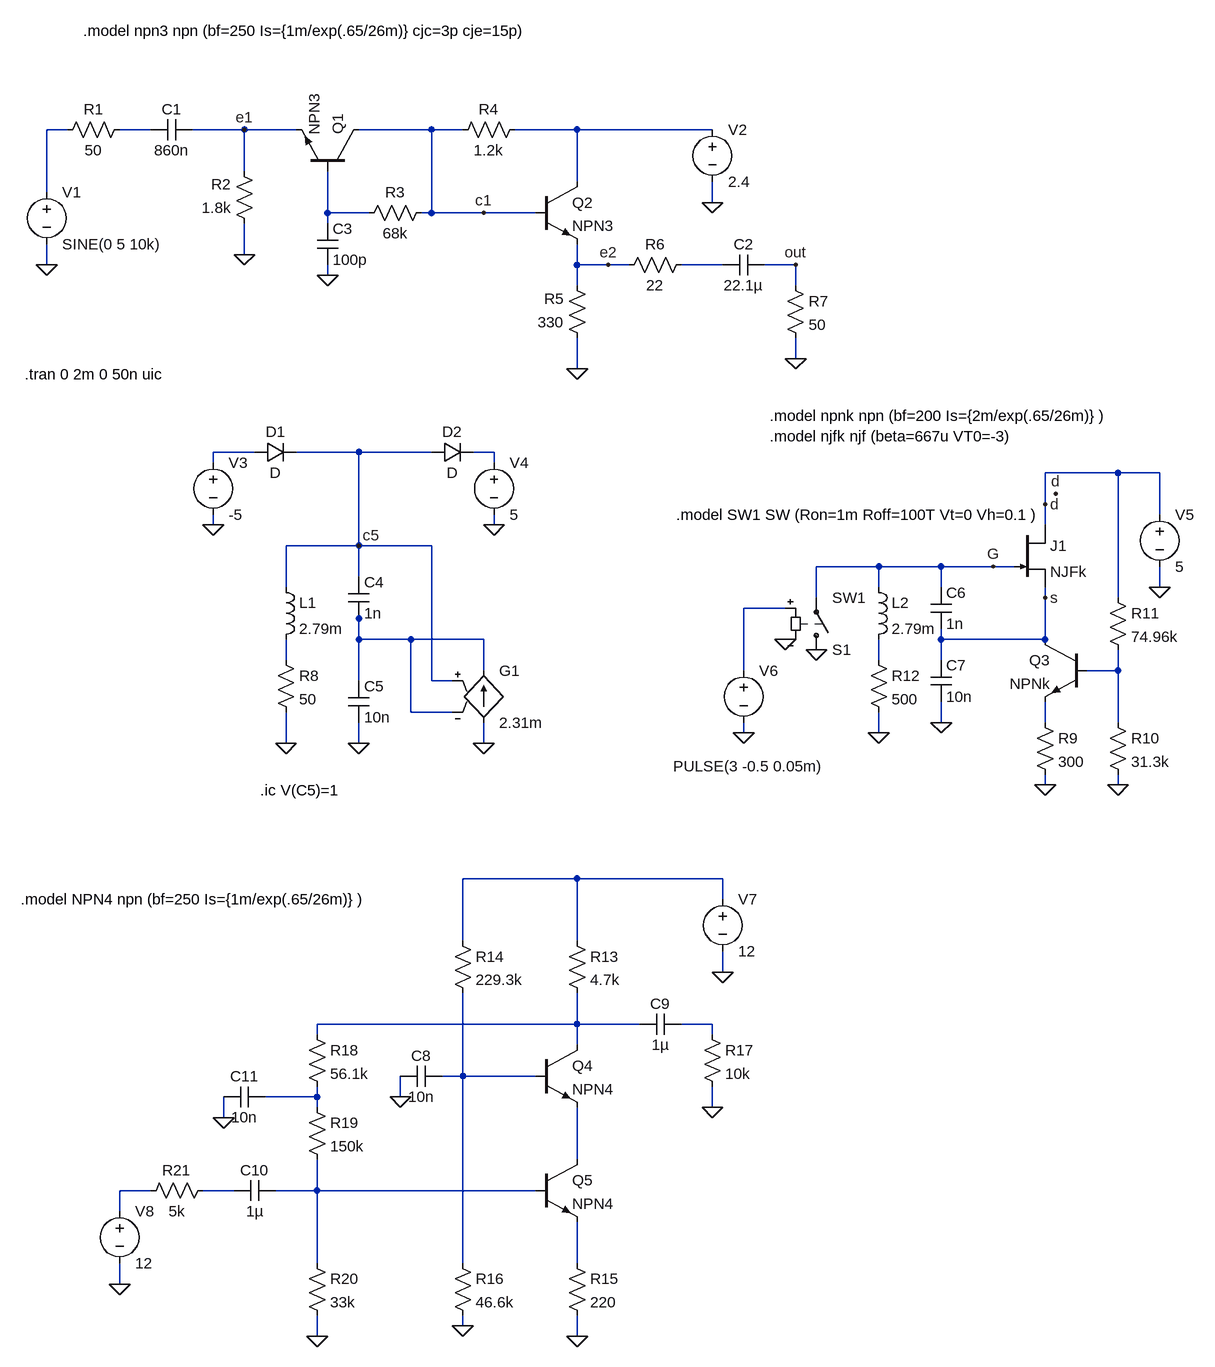
[diagram p0: schematic ss2013_NJF.asc]
ss2013_NJF.asc, the LTspice schematic file:
Version 4
SHEET 1 2028 2292
WIRE 288 400 256 400
WIRE 416 400 368 400
WIRE 560 400 480 400
WIRE 640 400 560 400
WIRE 848 400 736 400
WIRE 896 400 848 400
WIRE 1072 400 976 400
WIRE 1280 400 1072 400
WIRE 560 464 560 400
WIRE 1072 480 1072 400
WIRE 256 496 256 400
WIRE 1280 512 1280 480
WIRE 688 528 688 464
WIRE 752 528 688 528
WIRE 848 528 848 400
WIRE 848 528 832 528
WIRE 928 528 848 528
WIRE 1008 528 928 528
WIRE 688 544 688 528
WIRE 560 592 560 544
WIRE 256 608 256 576
WIRE 1072 608 1072 576
WIRE 1120 608 1072 608
WIRE 1152 608 1120 608
WIRE 1296 608 1232 608
WIRE 1408 608 1360 608
WIRE 688 624 688 608
WIRE 1072 640 1072 608
WIRE 1408 640 1408 608
WIRE 1408 752 1408 720
WIRE 1072 768 1072 720
WIRE 576 896 512 896
WIRE 736 896 640 896
WIRE 848 896 736 896
WIRE 944 896 912 896
WIRE 512 912 512 896
WIRE 944 912 944 896
WIRE 1904 928 1792 928
WIRE 1968 928 1904 928
WIRE 1792 976 1792 928
WIRE 1968 992 1968 928
WIRE 512 1008 512 992
WIRE 944 1008 944 992
WIRE 1792 1008 1792 976
WIRE 736 1040 736 896
WIRE 736 1040 624 1040
WIRE 848 1040 736 1040
WIRE 1536 1072 1440 1072
WIRE 1632 1072 1536 1072
WIRE 1712 1072 1632 1072
WIRE 1744 1072 1712 1072
WIRE 736 1088 736 1040
WIRE 624 1104 624 1040
WIRE 1536 1104 1536 1072
WIRE 1632 1104 1632 1072
WIRE 1968 1104 1968 1072
WIRE 1440 1120 1440 1072
WIRE 1792 1120 1792 1104
WIRE 1904 1120 1904 928
WIRE 1392 1136 1328 1136
WIRE 736 1152 736 1136
WIRE 736 1184 736 1152
WIRE 816 1184 736 1184
WIRE 928 1184 816 1184
WIRE 1632 1184 1632 1168
WIRE 1792 1184 1792 1120
WIRE 1792 1184 1632 1184
WIRE 624 1216 624 1184
WIRE 1536 1216 1536 1184
WIRE 1632 1216 1632 1184
WIRE 928 1232 928 1184
WIRE 1328 1232 1328 1136
WIRE 1904 1232 1904 1200
WIRE 1904 1232 1856 1232
WIRE 736 1248 736 1184
WIRE 848 1248 848 1040
WIRE 880 1248 848 1248
WIRE 816 1296 816 1184
WIRE 880 1296 816 1296
WIRE 1632 1312 1632 1280
WIRE 1792 1312 1792 1280
WIRE 1904 1312 1904 1232
WIRE 1328 1328 1328 1312
WIRE 1536 1328 1536 1296
WIRE 624 1344 624 1296
WIRE 736 1344 736 1312
WIRE 928 1344 928 1312
WIRE 1792 1408 1792 1392
WIRE 1904 1408 1904 1392
WIRE 1072 1552 896 1552
WIRE 1296 1552 1072 1552
WIRE 1296 1584 1296 1552
WIRE 896 1648 896 1552
WIRE 1072 1648 1072 1552
WIRE 1296 1696 1296 1664
WIRE 1072 1776 1072 1728
WIRE 1072 1776 672 1776
WIRE 1168 1776 1072 1776
WIRE 1280 1776 1232 1776
WIRE 672 1792 672 1776
WIRE 1280 1792 1280 1776
WIRE 1072 1808 1072 1776
WIRE 896 1856 896 1728
WIRE 896 1856 864 1856
WIRE 1008 1856 896 1856
WIRE 672 1888 672 1872
WIRE 672 1888 592 1888
WIRE 800 1888 800 1856
WIRE 672 1904 672 1888
WIRE 1280 1904 1280 1872
WIRE 528 1920 528 1888
WIRE 1072 1984 1072 1904
WIRE 416 2032 368 2032
WIRE 544 2032 496 2032
WIRE 672 2032 672 1984
WIRE 672 2032 608 2032
WIRE 1008 2032 672 2032
WIRE 368 2064 368 2032
WIRE 672 2144 672 2032
WIRE 896 2144 896 1856
WIRE 1072 2144 1072 2080
WIRE 368 2176 368 2144
WIRE 896 2240 896 2224
WIRE 672 2256 672 2224
WIRE 1072 2256 1072 2224
FLAG 1408 752 0
FLAG 1072 768 0
FLAG 256 608 0
FLAG 560 592 0
FLAG 688 624 0
FLAG 1280 512 0
FLAG 1408 608 out
FLAG 1120 608 e2
FLAG 928 528 c1
FLAG 560 400 e1
FLAG 928 1344 0
FLAG 736 1344 0
FLAG 624 1344 0
FLAG 736 1040 c5
FLAG 944 1008 0
FLAG 512 1008 0
FLAG 1968 1104 0
FLAG 1792 1408 0
FLAG 1904 1408 0
FLAG 1632 1312 0
FLAG 1536 1328 0
FLAG 1328 1328 0
FLAG 1440 1200 0
FLAG 1392 1184 0
FLAG 1712 1072 G
FLAG 1792 1120 s
FLAG 1808 960 d
FLAG 1792 976 d
FLAG 1296 1696 0
FLAG 896 2240 0
FLAG 368 2176 0
FLAG 672 2256 0
FLAG 1072 2256 0
FLAG 1280 1904 0
FLAG 800 1888 0
FLAG 528 1920 0
SYMBOL voltage 256 480 R0
WINDOW 123 24 124 Left 2
WINDOW 39 0 0 Left 2
SYMATTR InstName V1
SYMATTR Value SINE(0 5 10k)
SYMBOL cap 480 384 R90
WINDOW 0 0 32 VBottom 2
WINDOW 3 32 32 VTop 2
SYMATTR InstName C1
SYMATTR Value 860n
SYMBOL res 384 384 R90
WINDOW 0 0 56 VBottom 2
WINDOW 3 32 56 VTop 2
SYMATTR InstName R1
SYMATTR Value 50
SYMBOL res 576 560 R180
WINDOW 0 36 76 Left 2
WINDOW 3 36 40 Left 2
SYMATTR InstName R2
SYMATTR Value 1.8k
SYMBOL npn 736 464 M270
SYMATTR InstName Q1
SYMATTR Value NPN3
SYMBOL npn 1008 480 R0
SYMATTR InstName Q2
SYMATTR Value NPN3
SYMBOL res 848 512 R90
WINDOW 0 0 56 VBottom 2
WINDOW 3 32 56 VTop 2
SYMATTR InstName R3
SYMATTR Value 68k
SYMBOL res 992 384 R90
WINDOW 0 0 56 VBottom 2
WINDOW 3 32 56 VTop 2
SYMATTR InstName R4
SYMATTR Value 1.2k
SYMBOL res 1088 736 R180
WINDOW 0 36 76 Left 2
WINDOW 3 36 40 Left 2
SYMATTR InstName R5
SYMATTR Value 330
SYMBOL res 1136 624 R270
WINDOW 0 32 56 VTop 2
WINDOW 3 0 56 VBottom 2
SYMATTR InstName R6
SYMATTR Value 22
SYMBOL cap 1360 592 R90
WINDOW 0 0 32 VBottom 2
WINDOW 3 32 32 VTop 2
SYMATTR InstName C2
SYMATTR Value 22.1µ
SYMBOL res 1392 624 R0
SYMATTR InstName R7
SYMATTR Value 50
SYMBOL cap 672 544 R0
SYMATTR InstName C3
SYMATTR Value 100p
SYMBOL voltage 1280 384 R0
WINDOW 123 0 0 Left 2
WINDOW 39 0 0 Left 2
SYMATTR InstName V2
SYMATTR Value 2.4
SYMBOL g 928 1216 R0
SYMATTR InstName G1
SYMATTR Value 2.31m
SYMBOL cap 720 1088 R0
SYMATTR InstName C4
SYMATTR Value 1n
SYMBOL cap 720 1248 R0
SYMATTR InstName C5
SYMATTR Value 10n
SYMBOL ind 608 1088 R0
SYMATTR InstName L1
SYMATTR Value 2.79m
SYMBOL res 608 1200 R0
SYMATTR InstName R8
SYMATTR Value 50
SYMBOL voltage 512 896 R0
WINDOW 123 0 0 Left 2
WINDOW 39 0 0 Left 2
SYMATTR InstName V3
SYMATTR Value -5
SYMBOL voltage 944 896 R0
WINDOW 123 0 0 Left 2
WINDOW 39 0 0 Left 2
SYMATTR InstName V4
SYMATTR Value 5
SYMBOL diode 576 912 R270
WINDOW 0 32 32 VTop 2
WINDOW 3 0 32 VBottom 2
SYMATTR InstName D1
SYMBOL diode 848 912 R270
WINDOW 0 32 32 VTop 2
WINDOW 3 0 32 VBottom 2
SYMATTR InstName D2
SYMBOL njf 1744 1008 R0
SYMATTR InstName J1
SYMATTR Value NJFk
SYMBOL voltage 1968 976 R0
WINDOW 123 0 0 Left 2
WINDOW 39 0 0 Left 2
SYMATTR InstName V5
SYMATTR Value 5
SYMBOL npn 1856 1184 M0
SYMATTR InstName Q3
SYMATTR Value NPNk
SYMBOL res 1776 1296 R0
SYMATTR InstName R9
SYMATTR Value 300
SYMBOL res 1888 1296 R0
SYMATTR InstName R10
SYMATTR Value 31.3k
SYMBOL res 1888 1104 R0
SYMATTR InstName R11
SYMATTR Value 74.96k
SYMBOL cap 1616 1104 R0
SYMATTR InstName C6
SYMATTR Value 1n
SYMBOL cap 1616 1216 R0
SYMATTR InstName C7
SYMATTR Value 10n
SYMBOL ind 1520 1088 R0
SYMATTR InstName L2
SYMATTR Value 2.79m
SYMBOL res 1520 1200 R0
SYMATTR InstName R12
SYMATTR Value 500
SYMBOL voltage 1328 1216 R0
WINDOW 3 -108 163 Left 2
WINDOW 123 0 0 Left 2
WINDOW 39 0 0 Left 2
SYMATTR InstName V6
SYMATTR Value PULSE(3 -0.5 0.05m)
SYMBOL sw 1440 1216 M180
SYMATTR InstName S1
SYMATTR Value SW1
SYMBOL res 1056 1632 R0
SYMATTR InstName R13
SYMATTR Value 4.7k
SYMBOL res 880 1632 R0
SYMATTR InstName R14
SYMATTR Value 229.3k
SYMBOL voltage 1296 1568 R0
WINDOW 123 0 0 Left 2
WINDOW 39 0 0 Left 2
SYMATTR InstName V7
SYMATTR Value 12
SYMBOL npn 1008 1808 R0
SYMATTR InstName Q4
SYMATTR Value NPN4
SYMBOL npn 1008 1984 R0
SYMATTR InstName Q5
SYMATTR Value NPN4
SYMBOL res 1056 2128 R0
SYMATTR InstName R15
SYMATTR Value 220
SYMBOL res 880 2128 R0
SYMATTR InstName R16
SYMATTR Value 46.6k
SYMBOL cap 864 1840 R90
WINDOW 0 0 32 VBottom 2
WINDOW 3 32 32 VTop 2
SYMATTR InstName C8
SYMATTR Value 10n
SYMBOL cap 1232 1760 R90
WINDOW 0 0 32 VBottom 2
WINDOW 3 32 32 VTop 2
SYMATTR InstName C9
SYMATTR Value 1µ
SYMBOL res 1264 1776 R0
SYMATTR InstName R17
SYMATTR Value 10k
SYMBOL res 656 1776 R0
SYMATTR InstName R18
SYMATTR Value 56.1k
SYMBOL res 656 1888 R0
SYMATTR InstName R19
SYMATTR Value 150k
SYMBOL res 656 2128 R0
SYMATTR InstName R20
SYMATTR Value 33k
SYMBOL res 512 2016 R90
WINDOW 0 0 56 VBottom 2
WINDOW 3 32 56 VTop 2
SYMATTR InstName R21
SYMATTR Value 5k
SYMBOL cap 608 2016 R90
WINDOW 0 0 32 VBottom 2
WINDOW 3 32 32 VTop 2
SYMATTR InstName C10
SYMATTR Value 1µ
SYMBOL cap 592 1872 R90
WINDOW 0 0 32 VBottom 2
WINDOW 3 32 32 VTop 2
SYMATTR InstName C11
SYMATTR Value 10n
SYMBOL voltage 368 2048 R0
WINDOW 123 0 0 Left 2
WINDOW 39 0 0 Left 2
SYMATTR InstName V8
SYMATTR Value 12
TEXT 312 248 Left 2 !.model npn3 npn (bf=250 Is={1m/exp(.65/26m)} cjc=3p cje=15p)
TEXT 222 776 Left 2 !.tran 0 2m 0 50n uic
TEXT 584 1416 Left 2 !.ic V(C5)=1
TEXT 1368 840 Left 2 !.model npnk npn (bf=200 Is={2m/exp(.65/26m)} )\n.model njfk njf (beta=667u VT0=-3)
TEXT 1224 992 Left 2 !.model SW1 SW (Ron=1m Roff=100T Vt=0 Vh=0.1 )
TEXT 216 1584 Left 2 !.model NPN4 npn (bf=250 Is={1m/exp(.65/26m)} )

The netlist it stands for:
* ss2013_NJF.asc
V1 N001 0 SINE(0 5 10k)
C1 e1 N002 860n
R1 N002 N001 50
R2 0 e1 1.8k
Q1 c1 N004 e1 0 NPN3
Q2 N003 c1 e2 0 NPN3
R3 c1 N004 68k
R4 N003 c1 1.2k
R5 0 e2 330
R6 e2 N005 22
C2 out N005 22.1µ
R7 out 0 50
C3 N004 0 100p
V2 N003 0 2.4
G1 0 N009 c5 N009 2.31m
C4 c5 N009 1n
C5 N009 0 10n
L1 c5 N010 2.79m
R8 N010 0 50
V3 N006 0 -5
V4 N007 0 5
D1 N006 c5 D
D2 c5 N007 D
J1 d G s NJFk
V5 d 0 5
Q3 s N012 N013 0 NPNk
R9 N013 0 300
R10 N012 0 31.3k
R11 d N012 74.96k
C6 G s 1n
C7 s 0 10n
L2 G N011 2.79m
R12 N011 0 500
V6 N008 0 PULSE(3 -0.5 0.05m)
S1 0 G N008 0 SW1
R13 N014 N015 4.7k
R14 N014 N017 229.3k
V7 N014 0 12
Q4 N015 N017 N019 0 NPN4
Q5 N019 N022 N023 0 NPN4
R15 N023 0 220
R16 N017 0 46.6k
C8 N017 0 10n
C9 N016 N015 1µ
R17 N016 0 10k
R18 N015 N018 56.1k
R19 N018 N022 150k
R20 N022 0 33k
R21 N021 N020 5k
C10 N022 N021 1µ
C11 N018 0 10n
V8 N020 0 12
.model D D
.lib standard.dio
.model NPN NPN
.model PNP PNP
.lib standard.bjt
.model NJF NJF
.model PJF PJF
.lib standard.jft
.model npn3 npn (bf=250 Is={1m/exp(.65/26m)} cjc=3p cje=15p)
.tran 0 2m 0 50n uic
.ic V(C5)=1
.model npnk npn (bf=200 Is={2m/exp(.65/26m)} )
.model njfk njf (beta=667u VT0=-3)
.model SW1 SW (Ron=1m Roff=100T Vt=0 Vh=0.1 )
.model NPN4 npn (bf=250 Is={1m/exp(.65/26m)} )
.backanno
.end